# EAGLE design motiolab_badge (EAGLE 9.5.1)
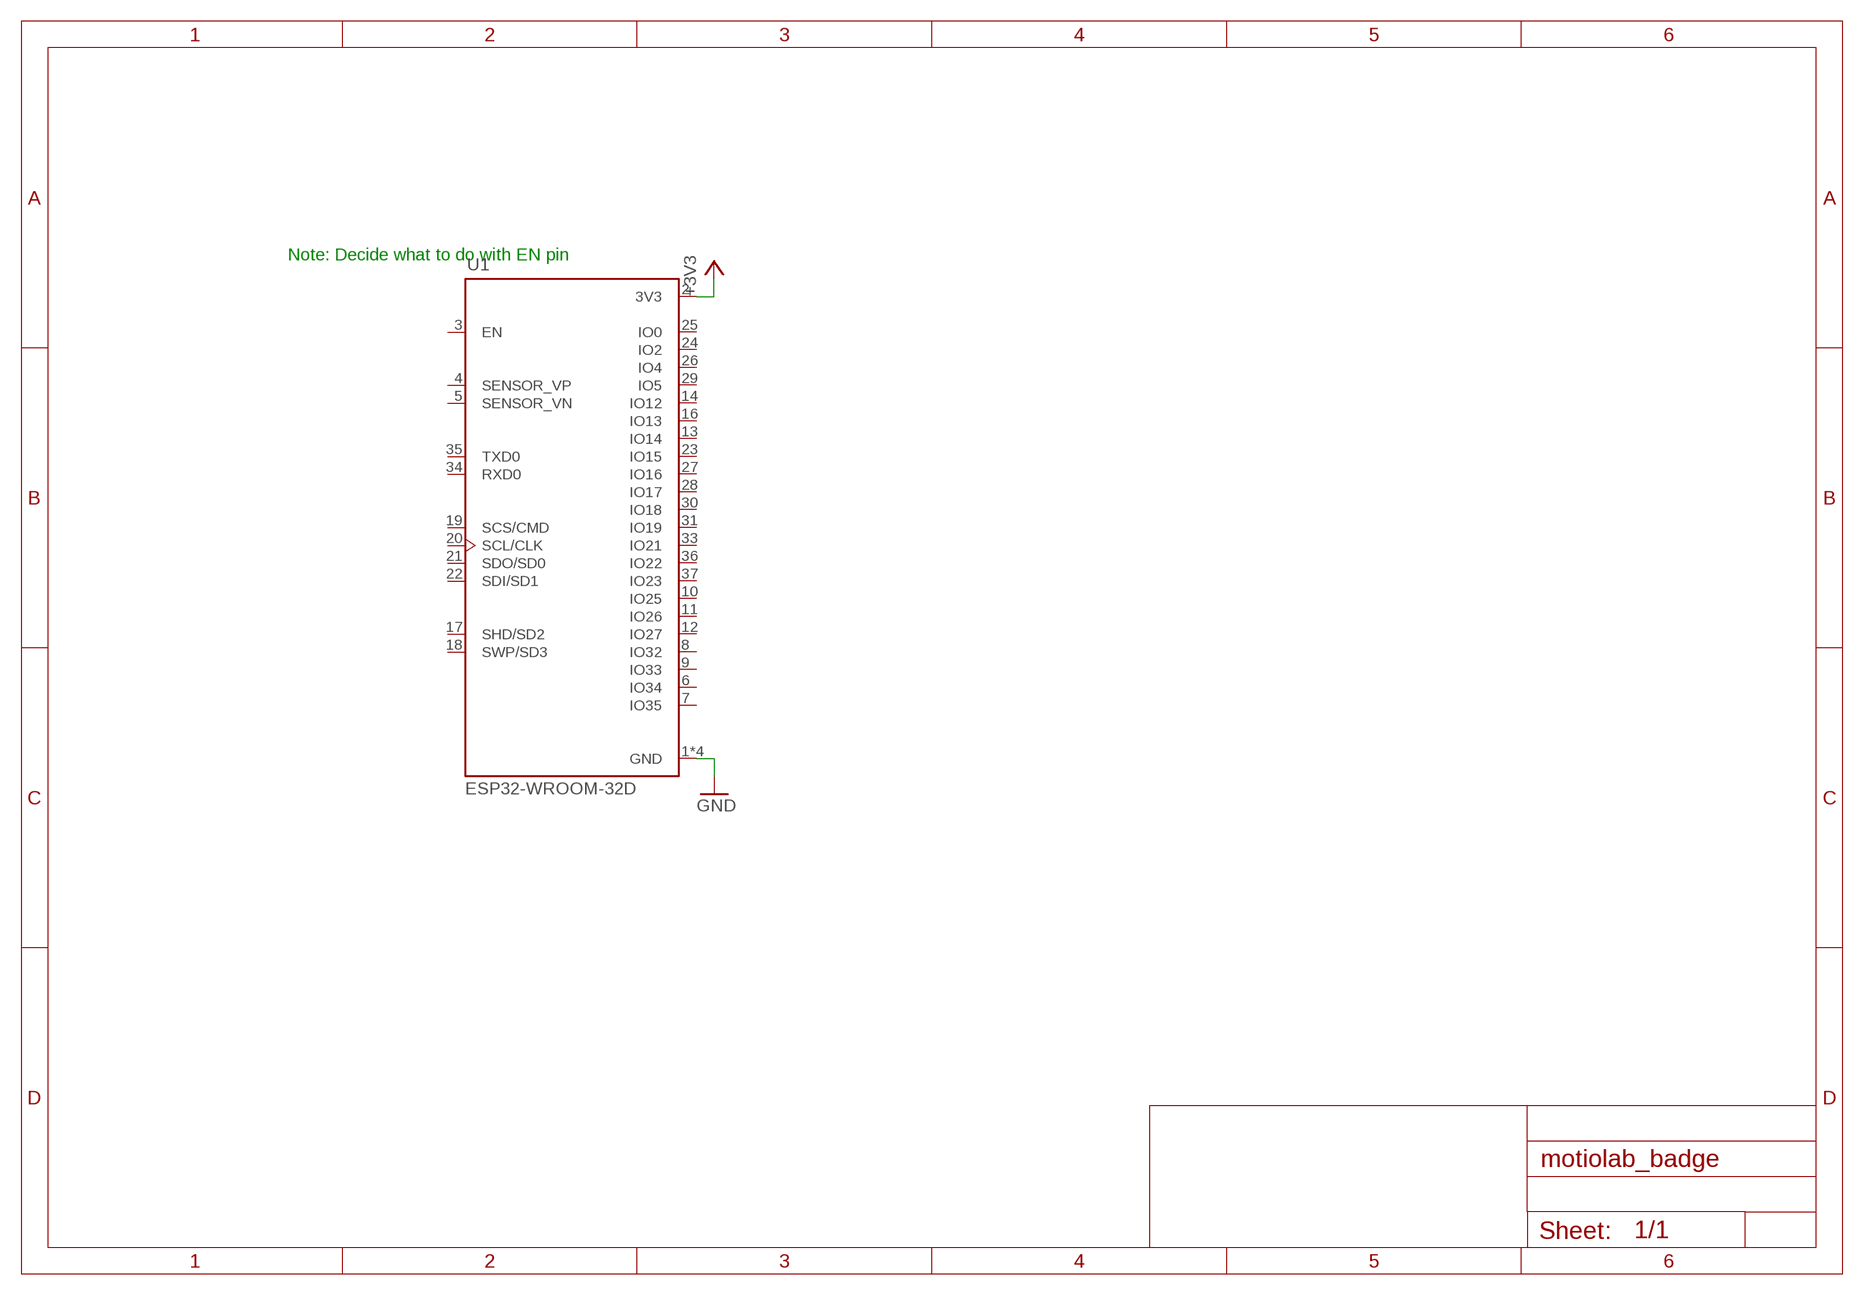
[diagram p0: schematic, sheet 1]

## Parts
U1  ESP32-WROOM-32D  [MODULE_ESP32-WROOM-32D]

## Nets
+3V3: U1.2(3V3)
GND: U1.1(GND) U1.15(GND) U1.38(GND) U1.39(GND)
Unconnected: U1.3(EN) U1.4(SENSOR_VP) U1.5(SENSOR_VN) U1.6(IO34) U1.7(IO35) U1.8(IO32) U1.9(IO33) U1.10(IO25) U1.11(IO26) U1.12(IO27) U1.13(IO14) U1.14(IO12) U1.16(IO13) U1.17(SHD/SD2) U1.18(SWP/SD3) U1.19(SCS/CMD) U1.20(SCL/CLK) U1.21(SDO/SD0) U1.22(SDI/SD1) U1.23(IO15) U1.24(IO2) U1.25(IO0) U1.26(IO4) U1.27(IO16) U1.28(IO17) U1.29(IO5) U1.30(IO18) U1.31(IO19) U1.33(IO21) U1.34(RXD0) U1.35(TXD0) U1.36(IO22) U1.37(IO23)

## Notes on the sheet
- Note: Decide what to do with EN pin

## Library data of the parts
U1 = ML_badge:ESP32-WROOM-32D: IC: SoC; GPIO, I2C, I2S, IR, SD, SDIO, SPI, UART; 2.7÷3.6VDC; 20dBm; AVAILABILITY: Unavailable; DISTRIBUTOR: Mouser; DISTRUBUTOR_REF: 356-ESP32WROOM-32D; MANUFACTURER: Espressif Systems; MANUFACTURER_REF: ESP32-WROOM-32D

## Board
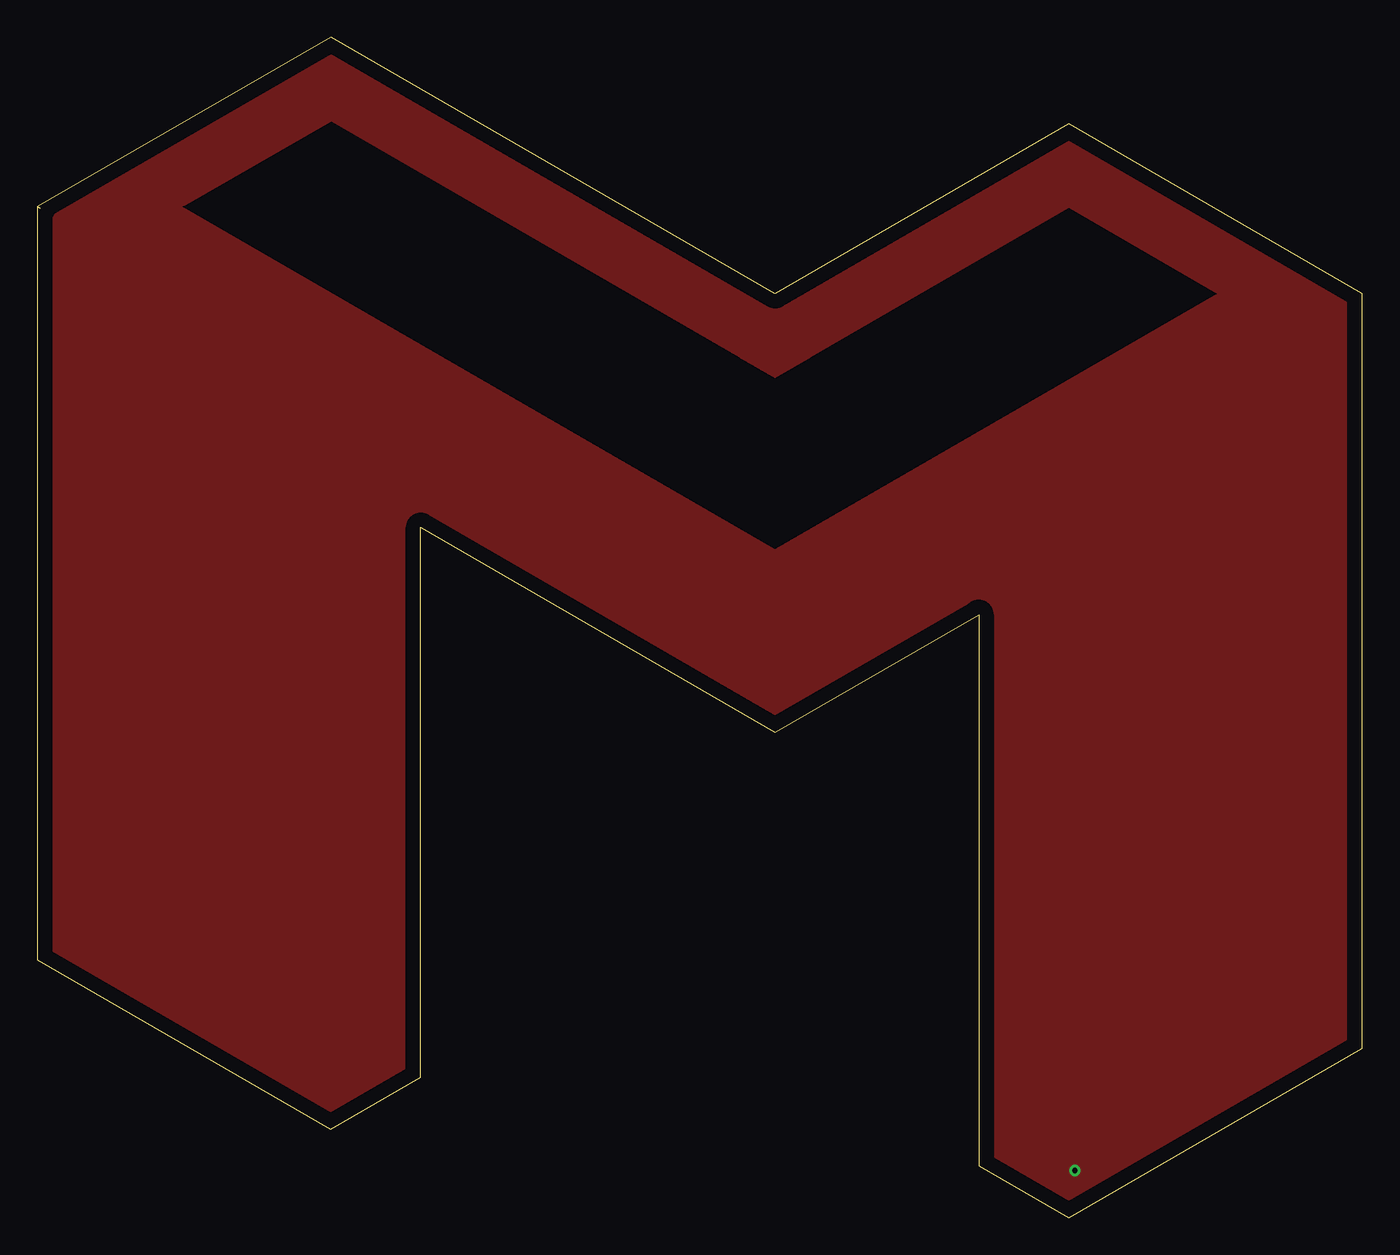
[diagram p1: board, top side]
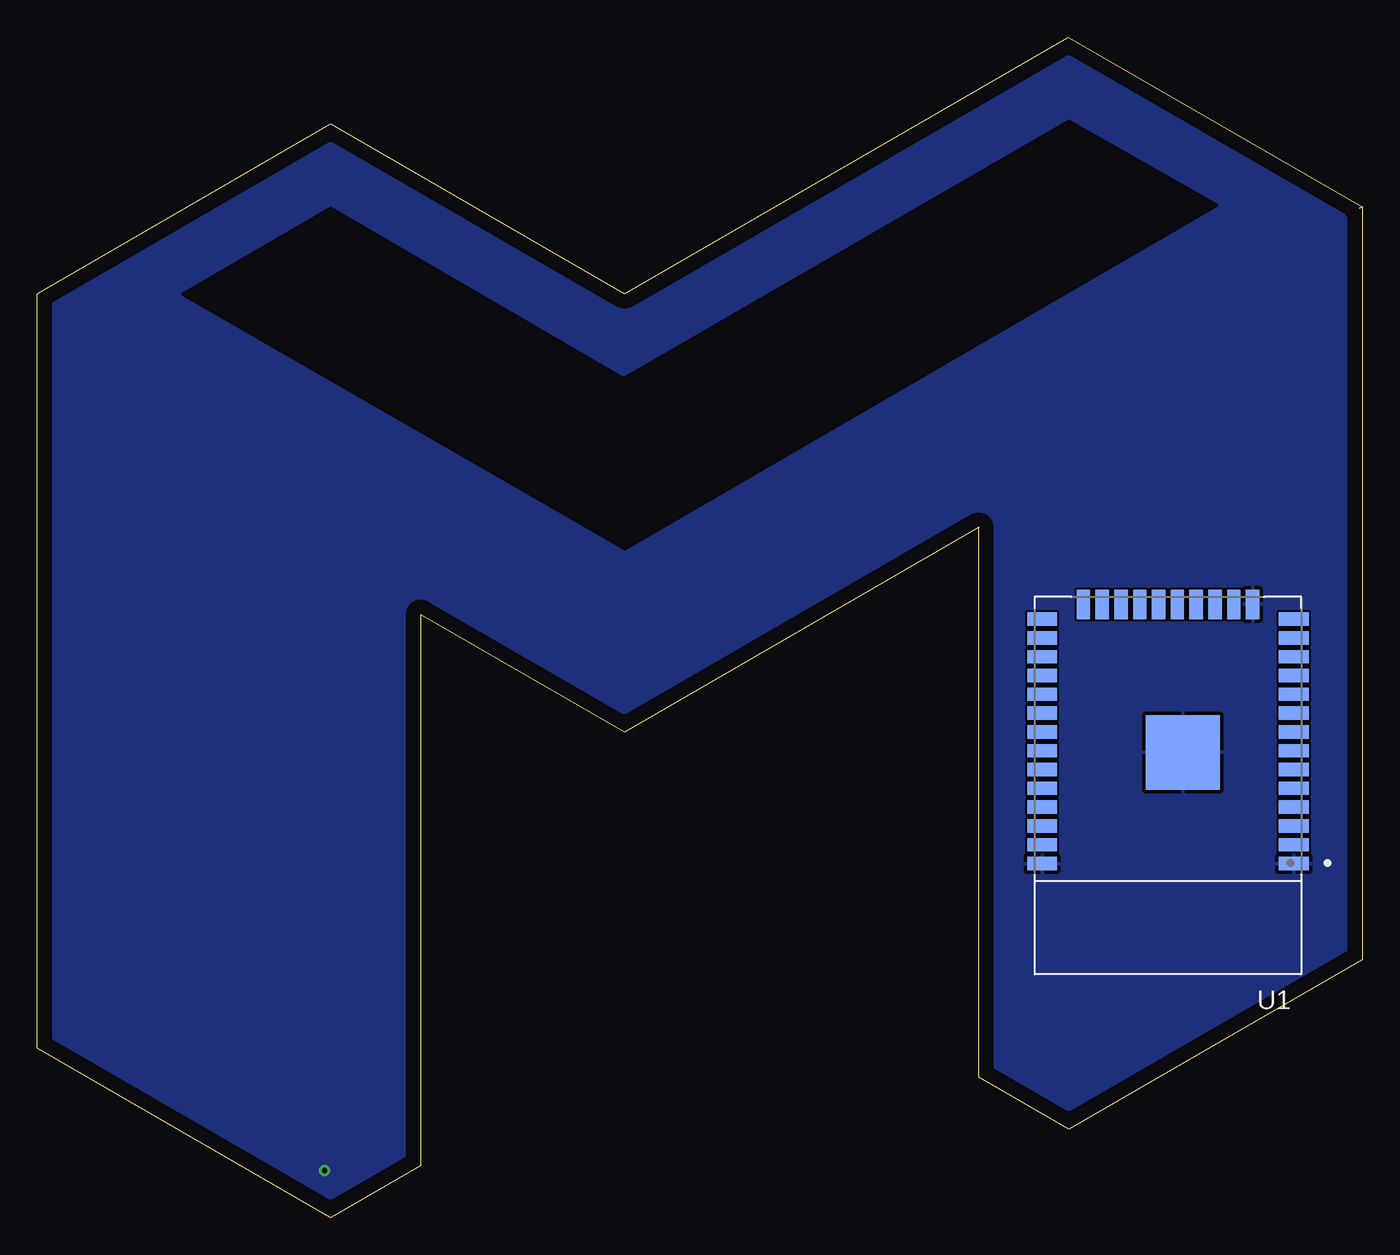
[diagram p2: board, bottom side, seen from below]

Size 89.58 x 79.78 mm. Coordinates in mm from the lower left corner, seen from the top.
Outline: 69.73,0 63.64,3.52 63.64,40.76 49.89,32.82 25.93,46.65 25.93,9.5 19.85,5.97 0,17.45 0,68.32 0.23,68.2 0,68.33 19.87,79.78 49.88,62.44 69.73,73.92 89.58,62.44 89.58,11.46 69.73,0
Outline: 69.73,0 69.73,0
Copper layers (1*16): Top 0.035mm / dielectric 1.5mm / Bottom 0.035mm
Design rules "default": minimum track width 6mil, minimum drill 0.35mm, track to track 6mil, track to pad 6mil, pad to pad 6mil, via to via 6mil, smd to smd 6mil, copper to edge 40mil, drill to drill 6mil, minimum pad ring 10mil, minimum via ring 8mil, stop-mask expansion 4mil, vias tented up to drill 0mil, thermal gap 10mil
tRestrict: 8 lines
bRestrict: area 9.8,45.2 to 79.7,74.1

### Footprints (pad centres in the part's own frame; a part is rotated, then mirrored left to right if it is on the bottom)
MODULE_ESP32-WROOM-32D = smd 2 x 0.9: 1 -8.5,5.26; 2 -8.5,3.99; 3 -8.5,2.72; 4 -8.5,1.45; 5 -8.5,0.18; 6 -8.5,-1.09; 7 -8.5,-2.36; 8 -8.5,-3.63; 9 -8.5,-4.9; 10 -8.5,-6.17; 11 -8.5,-7.44; 12 -8.5,-8.71; 13 -8.5,-9.98; 14 -8.5,-11.25; 25 8.5,-11.25; 26 8.5,-9.98; 27 8.5,-8.71; 28 8.5,-7.44; 29 8.5,-6.17; 30 8.5,-4.9; 31 8.5,-3.63; 32 8.5,-2.36; 33 8.5,-1.09; 34 8.5,0.18; 35 8.5,1.45; 36 8.5,2.72; 37 8.5,3.99; 38 8.5,5.26 | smd 0.9 x 2: 15 -5.715,-12.25; 16 -4.445,-12.25; 17 -3.175,-12.25; 18 -1.905,-12.25; 19 -0.635,-12.25; 20 0.635,-12.25; 21 1.905,-12.25; 22 3.175,-12.25; 23 4.445,-12.25; 24 5.715,-12.25 | smd 5 x 5: 39 -1,-2.24

### Placement (x,y rotation side)
U1  13.15,29.2 180 bottom

### Tracks (layer width: path | path; a pad name or v marks a point on that pad's centre or on a via)
GND  (via drill 0.35)
  other vias: 70.15,3.2
  pour Top: -0.85,81.2 90.15,81.2 90.15,-0.8 -0.85,-0.8
  pour Bottom: -1.85,82.2 91.15,82.2 91.15,-1.8 -1.85,-1.8